# EAGLE schematic VW (EAGLE 9.1.3)
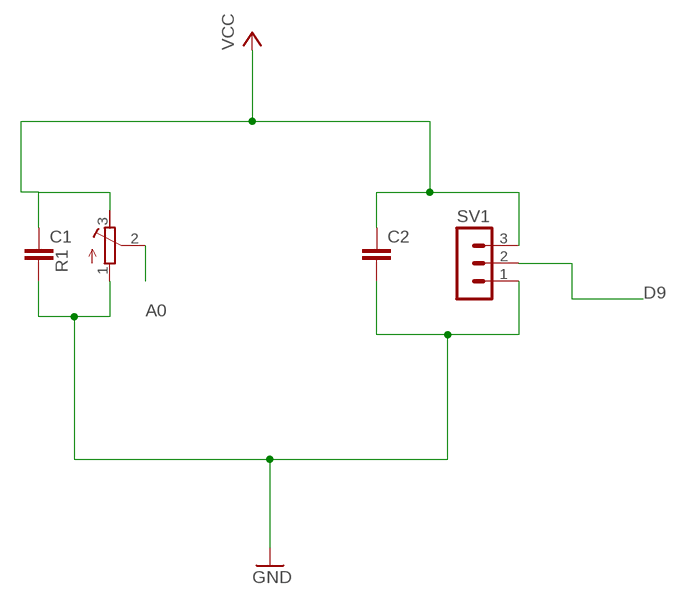
[diagram p0: schematic, sheet 1]

## Parts
C1  C2,5-3  [C2.5-3]
C2  C2,5-3  [C2.5-3]
R1  R-TRIMM4G/J  [RTRIM4G/J]
SV1  MA03-1  [MA03-1]

## Nets
A0: R1.2(S)
A5V: C1.1 C2.1 R1.3(E) SV1.3 ; supply symbol labelled VCC
D9: SV1.2
GND1: C1.2 C2.2 R1.1(A) SV1.1 ; supply symbol labelled GND

## Library data of the parts
C1 C2 = capacitor-wima:C: CAPACITOR naming: grid - package width
R1 = rcl:R-TRIMM: Trimm resistor; SPICEMODEL: X; SPICEPREFIXL: POT
SV1 = con-lstb:MA03-1: PIN HEADER; OC_FARNELL: unknown; OC_NEWARK: unknown